# EAGLE design Motor Slave_+_IMU sensor (EAGLE 9.5.2)
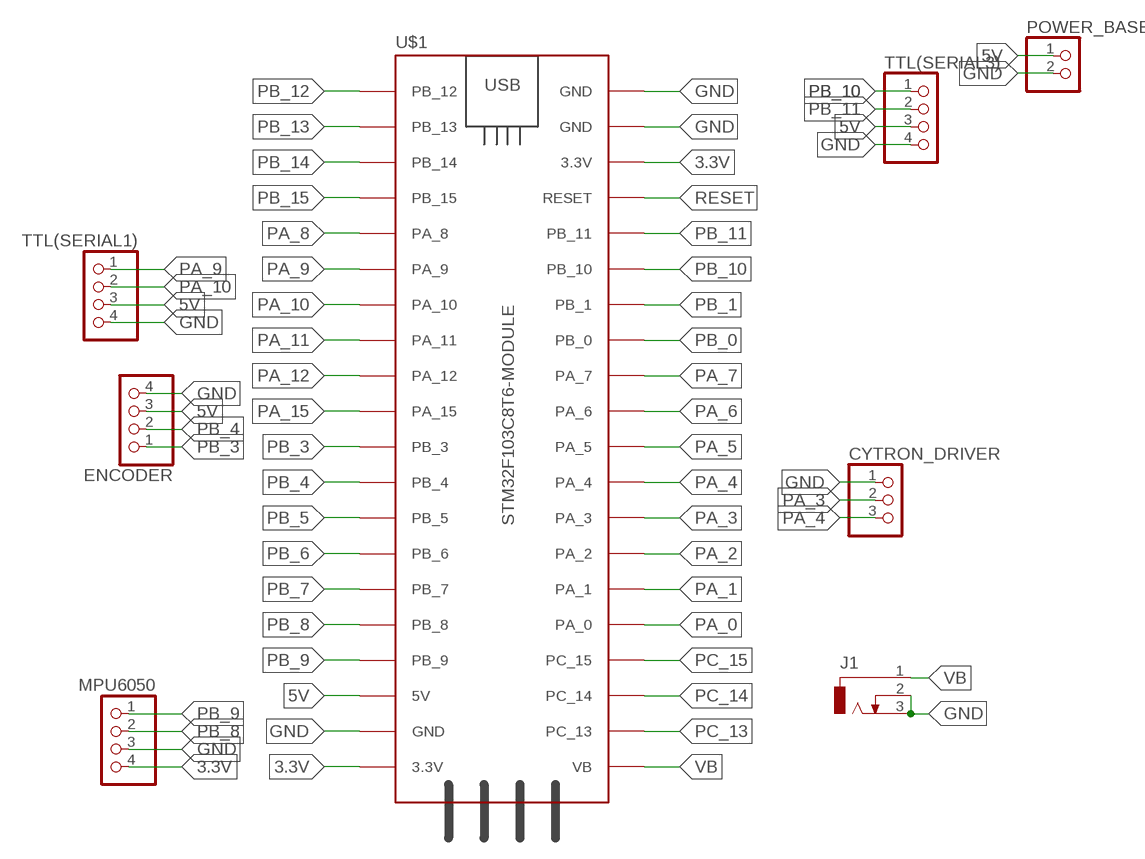
[diagram p0: schematic, sheet 1]

## Parts
CYTRON_DRIVER  PINHD-3_DATA  [1X03_DATA]
ENCODER  PINHD-4_DATA  [1X04_DATA]
J1  CON_JACK  [DCJ0303]
MPU6050  PINHD-4_DATA  [1X04_DATA]
POWER_BASE  PINHD-2_DATA  [1X02_DATA]
TTL(SERIAL1)  PINHD-4_DATA  [1X04_DATA]
TTL(SERIAL3)  PINHD-4_DATA  [1X04_DATA]
U$1  STM32F103C8T6-MODULE  [STM32F103C8T6-MODULE]

## Nets
3.3V: MPU6050.4 U$1.3.3V_1(3.3V) U$1.3.3V_2(3.3V)
5V: ENCODER.3 POWER_BASE.1 TTL(SERIAL1).3 TTL(SERIAL3).3 U$1.5V
GND: CYTRON_DRIVER.1 ENCODER.4 J1.2 J1.3 MPU6050.3 POWER_BASE.2 TTL(SERIAL1).4 TTL(SERIAL3).4 U$1.GND_1(GND) U$1.GND_2(GND) U$1.GND_3(GND)
PA_0: U$1.PA_0
PA_1: U$1.PA_1
PA_2: U$1.PA_2
PA_3: CYTRON_DRIVER.2 U$1.PA_3
PA_4: CYTRON_DRIVER.3 U$1.PA_4
PA_5: U$1.PA_5
PA_6: U$1.PA_6
PA_7: U$1.PA_7
PA_8: U$1.PA_8
PA_9: TTL(SERIAL1).1 U$1.PA_9
PA_10: TTL(SERIAL1).2 U$1.PA_10
PA_11: U$1.PA_11
PA_12: U$1.PA_12
PA_15: U$1.PA_15
PB_0: U$1.PB_0
PB_1: U$1.PB_1
PB_3: ENCODER.1 U$1.PB_3
PB_4: ENCODER.2 U$1.PB_4
PB_5: U$1.PB_5
PB_6: U$1.PB_6
PB_7: U$1.PB_7
PB_8: MPU6050.2 U$1.PB_8
PB_9: MPU6050.1 U$1.PB_9
PB_10: TTL(SERIAL3).1 U$1.PB_10
PB_11: TTL(SERIAL3).2 U$1.PB_11
PB_12: U$1.PB_12
PB_13: U$1.PB_13
PB_14: U$1.PB_14
PB_15: U$1.PB_15
PC_13: U$1.PC_13
PC_14: U$1.PC_14
PC_15: U$1.PC_15
RESET: U$1.RESET
VB: J1.1 U$1.VB

## Library data of the parts
CYTRON_DRIVER = MIA_LIBRARY-2-2-2:PINHD-3_DATA: PIN HEADER
ENCODER MPU6050 TTL(SERIAL1) TTL(SERIAL3) = MIA_LIBRARY-2-2-2:PINHD-4_DATA: PIN HEADER
J1 = MIA_LIBRARY-2-2-2:CON_JACK: DC POWER JACK Source: DCJ0303.pdf; OC_FARNELL: unknown; OC_NEWARK: unknown
POWER_BASE = MIA_LIBRARY-2-2-2:PINHD-2_DATA: PIN HEADER
U$1 = MIA_LIBRARY-2-2-2:STM32F103C8T6-MODULE: STM32F103C8T6 module with ARM Cortex-3, 20kB SRAM, 64kB Flash, 72MHz

## Board
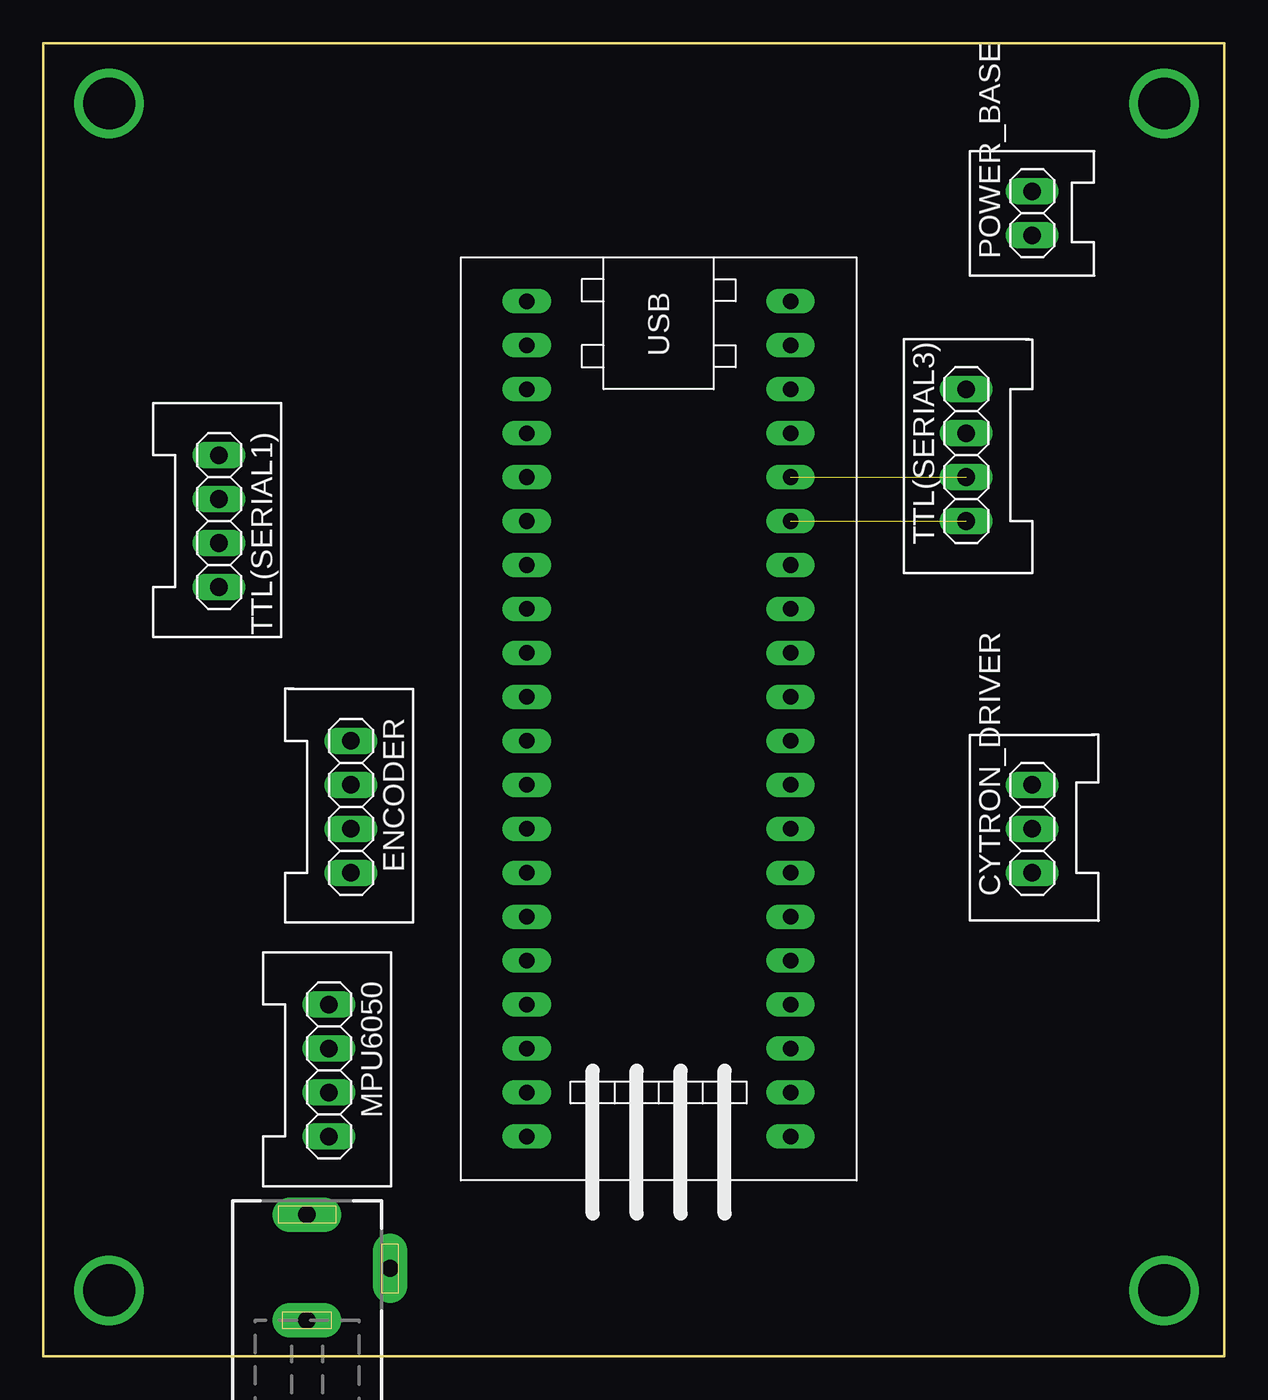
[diagram p1: board, top side]
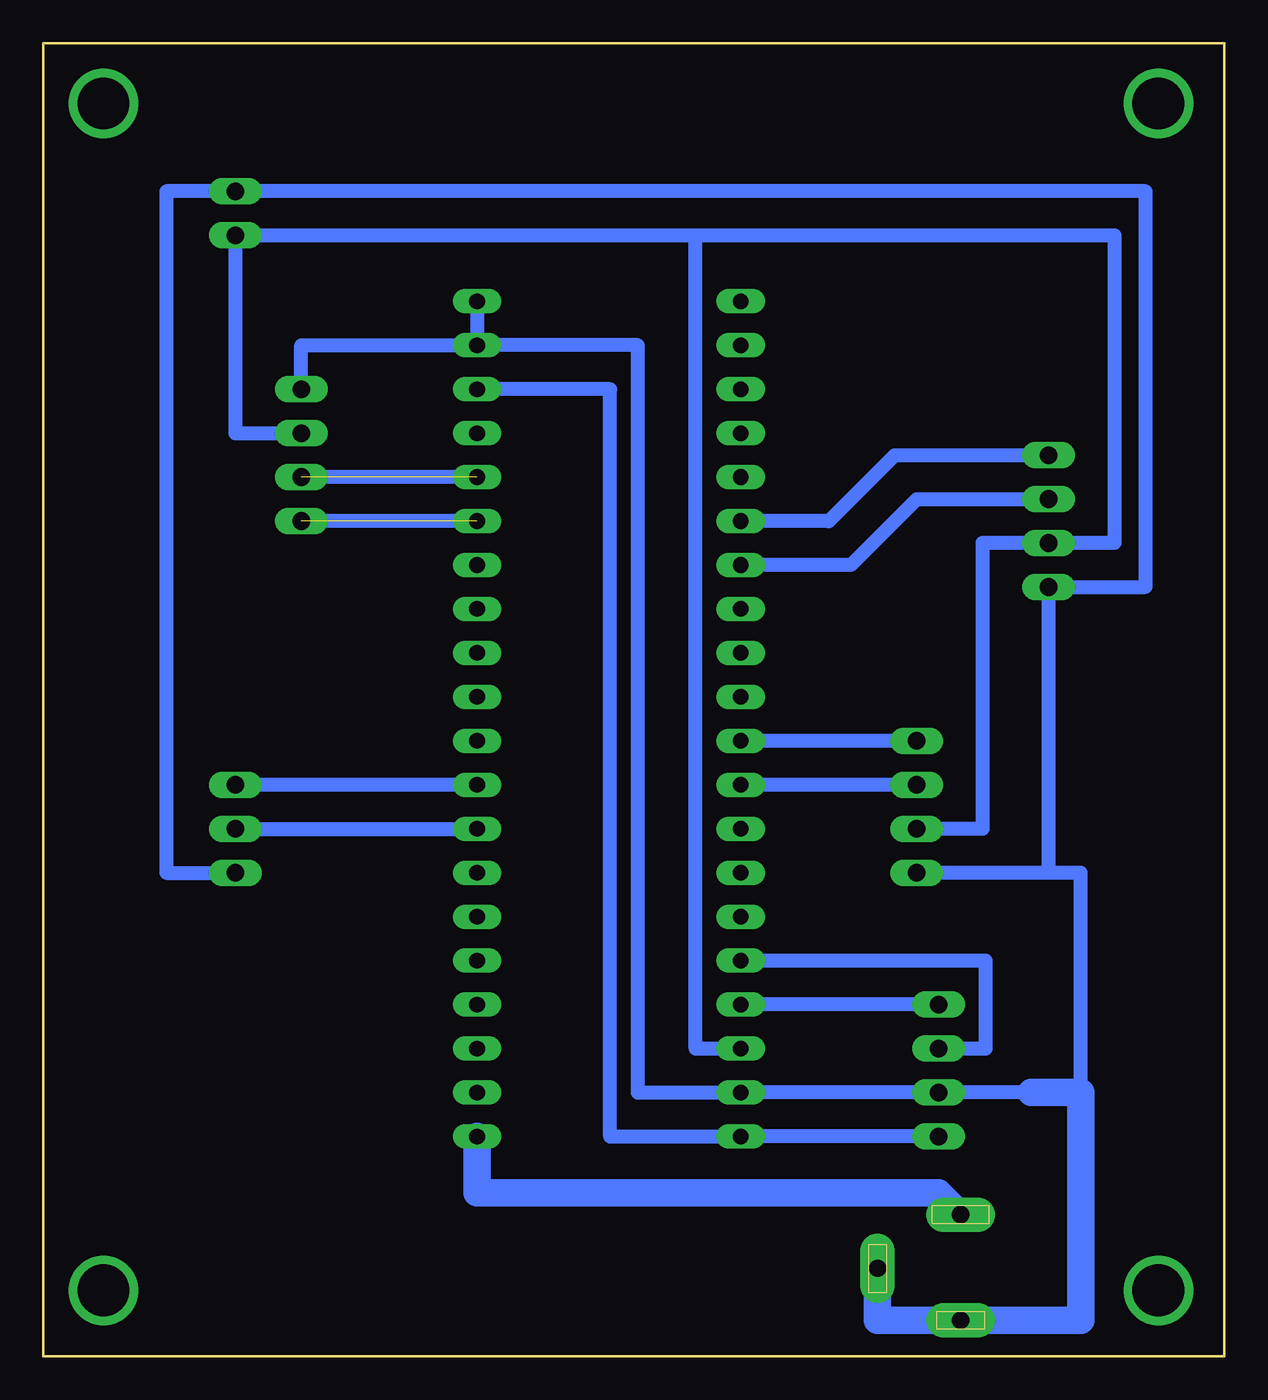
[diagram p2: board, bottom side, seen from below]

Size 68.25 x 75.87 mm. Coordinates in mm from the lower left corner, seen from the top.
Outline: 0,0 68.25,0 68.25,75.87 0,75.87 0,0
Copper layers (1*16): Top 0.035mm / dielectric 1.5mm / Bottom 0.035mm
Design rules "default *": minimum track width 0.8mm, minimum drill 0.35mm, track to track 0.8mm, track to pad 0.8mm, pad to pad 6mil, via to via 6mil, smd to smd 6mil, copper to edge 0.8mm, drill to drill 6mil, minimum pad ring 10mil, minimum via ring 8mil, stop-mask expansion 4mil, vias tented up to drill 0mil, thermal gap 10mil

### Footprints (pad centres in the part's own frame; a part is rotated, then mirrored left to right if it is on the bottom)
1X03_DATA = drill 1.016 long: 1 -2.54,0; 2 0,0; 3 2.54,0
1X04_DATA = drill 1.016 long: 1 -3.81,0; 2 -1.27,0; 3 1.27,0; 4 3.81,0
DCJ0303 = drill 1 pad 2 long: 1 0,3.1; 2 4.8,0; 3 0,-3
1X02_DATA = drill 1.016 long: 1 -1.27,0; 2 1.27,0
STM32F103C8T6-MODULE = drill 0.9 long: 3.3V_1 25.4,-7.62; 3.3V_2 -17.78,7.62; 5V 20.32,-7.62; GND_1 22.86,-7.62; GND_2 -20.32,7.62; GND_3 -22.86,7.62; PA_0 15.24,7.62; PA_1 12.7,7.62; PA_2 10.16,7.62; PA_3 7.62,7.62; PA_4 5.08,7.62; PA_5 2.54,7.62; PA_6 0,7.62; PA_7 -2.54,7.62; PA_8 -12.7,-7.62; PA_9 -10.16,-7.62; PA_10 -7.62,-7.62; PA_11 -5.08,-7.62; PA_12 -2.54,-7.62; PA_15 0,-7.62; PB_0 -5.08,7.62; PB_1 -7.62,7.62; PB_3 2.54,-7.62; PB_4 5.08,-7.62; PB_5 7.62,-7.62; PB_6 10.16,-7.62; PB_7 12.7,-7.62; PB_8 15.24,-7.62; PB_9 17.78,-7.62; PB_10 -10.16,7.62; PB_11 -12.7,7.62; PB_12 -22.86,-7.62; PB_13 -20.32,-7.62; PB_14 -17.78,-7.62; PB_15 -15.24,-7.62; PC_13 22.86,7.62; PC_14 20.32,7.62; PC_15 17.78,7.62; RESET -15.24,7.62; VB 25.4,7.62

### Placement (x,y rotation side)
CYTRON_DRIVER  57.15,30.48 90 top
ENCODER  17.78,31.75 270 top
J1  15.24,5.08 0 top
MPU6050  16.51,16.51 270 top
POWER_BASE  57.15,66.04 90 top
TTL(SERIAL1)  10.16,48.26 270 top
TTL(SERIAL3)  53.34,52.07 90 top
U$1  35.56,38.1 270 top

### Tracks (layer width: path | path; a pad name or v marks a point on that pad's centre or on a via)
3.3V
  Bottom 0.8: MPU6050.4 U$1.3.3V_1 35.49,12.7 35.49,55.88 U$1.3.3V_2
5V
  Bottom 0.8: TTL(SERIAL3).3 57.15,53.34 POWER_BASE.1 30.55,64.77 | ENCODER.3 13.97,30.48 13.97,46.99 TTL(SERIAL1).3 6.35,46.99 6.35,64.77 30.55,64.77 | U$1.5V 30.55,17.78 30.55,64.77
GND
  Bottom 0.8: U$1.GND_3 U$1.GND_2 | TTL(SERIAL3).4 53.34,58.42 U$1.GND_2 | 11.14,15.24 MPU6050.3 U$1.GND_1 33.89,15.24 33.89,58.42 U$1.GND_2 | CYTRON_DRIVER.1 61.14,27.94 61.14,67.31 POWER_BASE.2 4.57,67.31 4.57,44.45 TTL(SERIAL1).4 10.16,27.94 | 8.31,15.24 8.31,27.94 10.16,27.94 | 10.16,27.94 ENCODER.4
  Bottom 1.6: J1.2 20.04,2.08 J1.3 8.31,2.08 8.31,15.24 11.14,15.24
N$1  (via drill 3)
  other vias: 3.81,72.39
N$2  (via drill 3)
  other vias: 64.77,72.39
N$3  (via drill 3)
  other vias: 64.77,3.81
N$4  (via drill 3)
  other vias: 3.81,3.81
PA_3
  Bottom 0.8: CYTRON_DRIVER.2 U$1.PA_3
PA_4
  Bottom 0.8: U$1.PA_4 CYTRON_DRIVER.3
PA_9
  Bottom 0.8: TTL(SERIAL1).1 19.05,52.07 22.86,48.26 U$1.PA_9
PA_10
  Bottom 0.8: U$1.PA_10 21.59,45.72 17.78,49.53 TTL(SERIAL1).2
PB_3
  Bottom 0.8: ENCODER.1 U$1.PB_3
PB_4
  Bottom 0.8: ENCODER.2 U$1.PB_4
PB_8
  Bottom 0.8: U$1.PB_8 13.79,22.86 13.79,17.78 MPU6050.2
PB_9
  Bottom 0.8: MPU6050.1 U$1.PB_9
PB_10  (1 unrouted)
  Bottom 0.8: U$1.PB_10 TTL(SERIAL3).1
PB_11  (1 unrouted)
  Bottom 0.8: U$1.PB_11 TTL(SERIAL3).2
VB
  Bottom 1.6: U$1.VB 43.18,9.45 16.51,9.45 J1.1